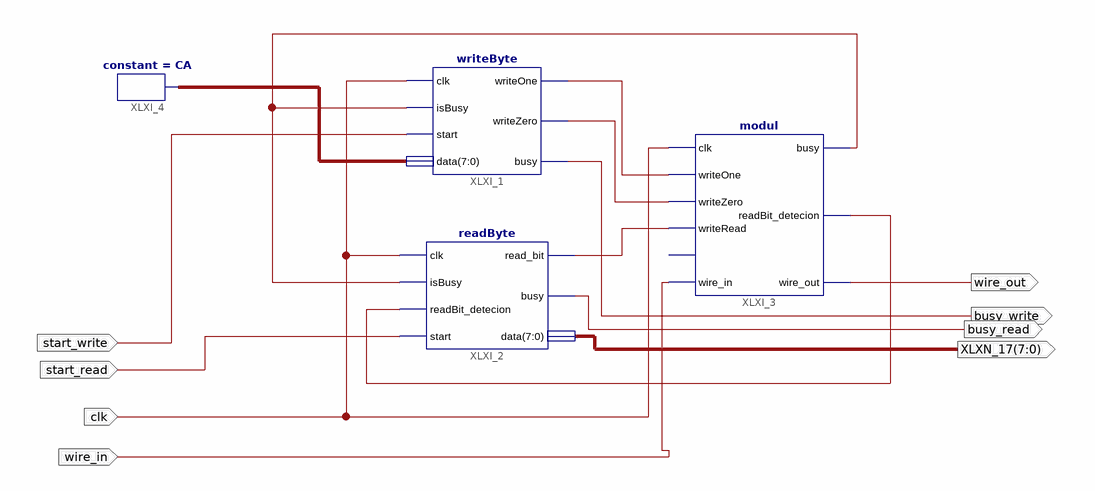
[diagram p0: schematic sheet 1]
// Xilinx ISE schematic testSchema.sch (spartan3e) as structural Verilog: 4 symbols, 8 ports
module testSchema (
  input  clk,
  input  start_write,
  input  start_read,
  input  wire_in,
  output wire_out,
  output busy_write,
  output busy_read,
  output [7:0] XLXN_17
);

  wire XLXN_1, XLXN_2, XLXN_3, XLXN_7, XLXN_8;
  wire [7:0] XLXN_11;

  writeByte XLXI_1 (
    .clk(clk), .isBusy(XLXN_7), .start(start_write), .data(XLXN_11), .writeOne(XLXN_2), .writeZero(XLXN_1),
    .busy(busy_write));
  readByte XLXI_2 (
    .clk(clk), .isBusy(XLXN_7), .readBit_detecion(XLXN_8), .start(start_read), .read_bit(XLXN_3),
    .busy(busy_read), .data(XLXN_17));
  modul XLXI_3 (
    .clk(clk), .writeOne(XLXN_2), .writeZero(XLXN_1), .writeRead(XLXN_3), .wire_in(wire_in), .busy(XLXN_7),
    .readBit_detecion(XLXN_8), .wire_out(wire_out));  // open: writeReset
  constant #(.CValue("CA")) XLXI_4 (.O(XLXN_11));
endmodule
